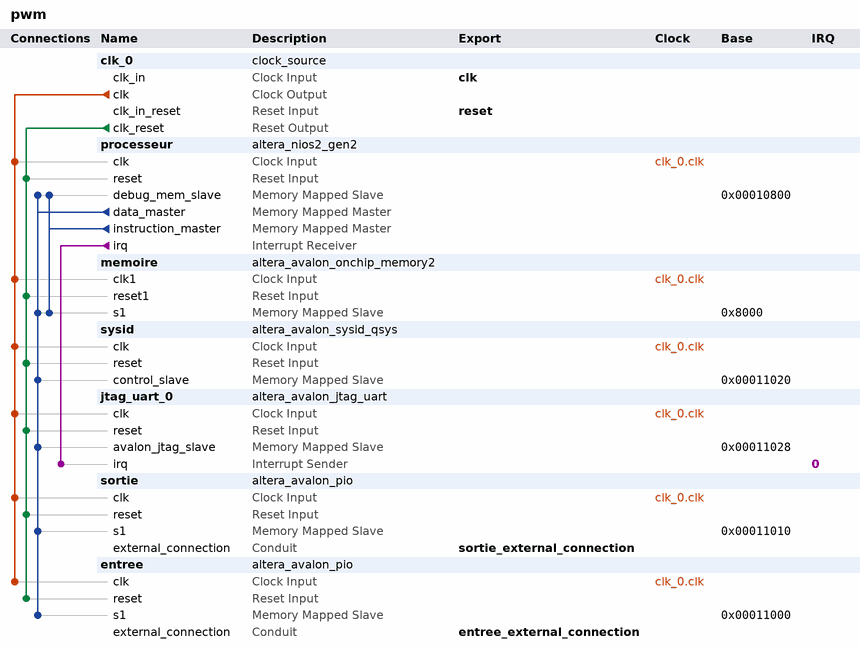
[diagram p0: system contents]
# Platform Designer (Qsys) system pwm, Cyclone IV E EP4CE22F17C6
# Parameters at their usual value, and those the tool derives, are not listed.
package require -exact qsys 22.1
create_system pwm
set_project_property DEVICE_FAMILY {Cyclone IV E}
set_project_property DEVICE EP4CE22F17C6

add_instance clk_0 clock_source 22.1
set_instance_parameter_value clk_0 clockFrequency 50000000

add_instance processeur altera_nios2_gen2 22.1
set_instance_parameter_value processeur dcache_size 2048
set_instance_parameter_value processeur exceptionSlave memoire.s1
set_instance_parameter_value processeur icache_size 4096
set_instance_parameter_value processeur impl Tiny
set_instance_parameter_value processeur resetSlave memoire.s1

add_instance memoire altera_avalon_onchip_memory2 22.1
set_instance_parameter_value memoire dataWidth 32
set_instance_parameter_value memoire dualPort false
set_instance_parameter_value memoire initMemContent true
set_instance_parameter_value memoire initializationFileName onchip_mem.hex
set_instance_parameter_value memoire memorySize 20000

add_instance sysid altera_avalon_sysid_qsys 22.1
set_instance_parameter_value sysid id 0

add_instance jtag_uart_0 altera_avalon_jtag_uart 22.1
set_instance_parameter_value jtag_uart_0 simInteractiveOptions NO_INTERACTIVE_WINDOWS

add_instance sortie altera_avalon_pio 22.1
set_instance_parameter_value sortie direction Output
set_instance_parameter_value sortie width 8

add_instance entree altera_avalon_pio 22.1
set_instance_parameter_value entree direction Input
set_instance_parameter_value entree width 8

# connections
add_connection clk_0.clk entree.clk clock
add_connection clk_0.clk jtag_uart_0.clk clock
add_connection clk_0.clk memoire.clk1 clock
add_connection clk_0.clk processeur.clk clock
add_connection clk_0.clk sortie.clk clock
add_connection clk_0.clk sysid.clk clock
add_connection clk_0.clk_reset entree.reset reset
add_connection clk_0.clk_reset jtag_uart_0.reset reset
add_connection clk_0.clk_reset memoire.reset1 reset
add_connection clk_0.clk_reset processeur.reset reset
add_connection clk_0.clk_reset sortie.reset reset
add_connection clk_0.clk_reset sysid.reset reset
add_connection processeur.data_master entree.s1 avalon
set_connection_parameter_value processeur.data_master/entree.s1 baseAddress 0x00011000
add_connection processeur.data_master jtag_uart_0.avalon_jtag_slave avalon
set_connection_parameter_value processeur.data_master/jtag_uart_0.avalon_jtag_slave baseAddress 0x00011028
add_connection processeur.data_master memoire.s1 avalon
set_connection_parameter_value processeur.data_master/memoire.s1 baseAddress 0x8000
add_connection processeur.data_master processeur.debug_mem_slave avalon
set_connection_parameter_value processeur.data_master/processeur.debug_mem_slave baseAddress 0x00010800
add_connection processeur.data_master sortie.s1 avalon
set_connection_parameter_value processeur.data_master/sortie.s1 baseAddress 0x00011010
add_connection processeur.data_master sysid.control_slave avalon
set_connection_parameter_value processeur.data_master/sysid.control_slave baseAddress 0x00011020
add_connection processeur.instruction_master memoire.s1 avalon
set_connection_parameter_value processeur.instruction_master/memoire.s1 baseAddress 0x8000
add_connection processeur.instruction_master processeur.debug_mem_slave avalon
set_connection_parameter_value processeur.instruction_master/processeur.debug_mem_slave baseAddress 0x00010800
add_connection processeur.irq jtag_uart_0.irq interrupt
set_connection_parameter_value processeur.irq/jtag_uart_0.irq irqNumber 0

# exported interfaces
add_interface clk clock sink
set_interface_property clk EXPORT_OF clk_0.clk_in
add_interface entree_external_connection conduit end
set_interface_property entree_external_connection EXPORT_OF entree.external_connection
add_interface reset reset sink
set_interface_property reset EXPORT_OF clk_0.clk_in_reset
add_interface sortie_external_connection conduit end
set_interface_property sortie_external_connection EXPORT_OF sortie.external_connection

set_interconnect_requirement {$system} qsys_mm.clockCrossingAdapter HANDSHAKE
set_interconnect_requirement {$system} qsys_mm.enableEccProtection FALSE
set_interconnect_requirement {$system} qsys_mm.insertDefaultSlave FALSE
set_interconnect_requirement {$system} qsys_mm.maxAdditionalLatency 1

save_system pwm.qsys
